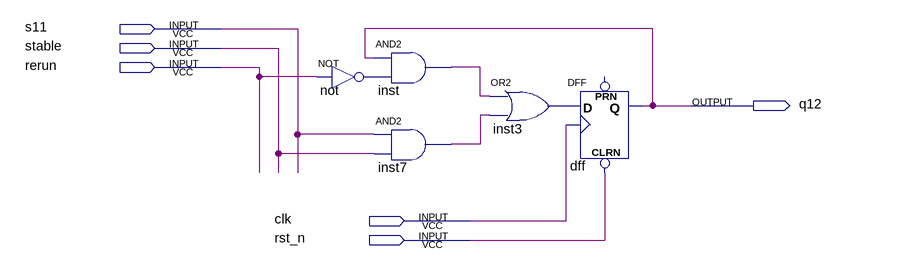
[diagram p0: schematic sheet]
// Quartus schematic s12.bdf as structural Verilog: 5 symbols, 6 pins
module s12 (
  input  s11,
  input  stable,
  input  rerun,
  input  clk,
  input  rst_n,
  output q12
);

  wire inst3_out, inst7_out, inst_out, not_out;

  not \not  (not_out, rerun);
  and inst (inst_out, q12, not_out);
  and inst7 (inst7_out, s11, stable);
  or inst3 (inst3_out, inst_out, inst7_out);
  DFF dff (.CLRN(rst_n), .CLK(clk), .D(inst3_out), .Q(q12));  // open: PRN
endmodule
